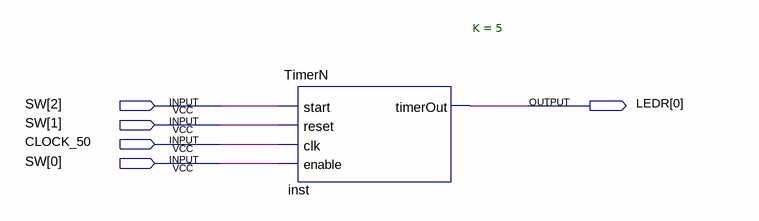
[diagram p0: schematic sheet]
// Quartus schematic TimerN_Demo.bdf as structural Verilog: 1 symbols, 5 pins
module TimerN_Demo (
  input  [2:0] SW,
  input  CLOCK_50,
  output [0:0] LEDR
);

  TimerN #(.K(5)) inst (.start(SW[2]), .reset(SW[1]), .clk(CLOCK_50), .enable(SW[0]), .timerOut(LEDR[0]));
endmodule
